# EAGLE design ISP_adapter2 (EAGLE 9.1.0)
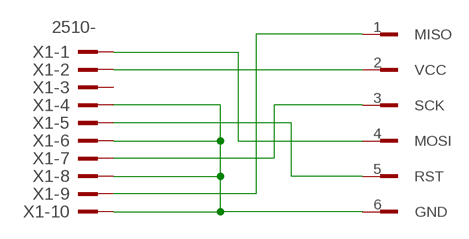
[diagram p0: schematic, sheet 1]

## Parts
U$1  ISP_CONN_6_MDRILL16  [ISP_CONN_6_M_DRILL16]
X1  2510-  [PAK100/2500-10]

## Nets
N$1: U$1.4(MOSI) X1.1
N$2: U$1.2(VCC) X1.2
N$3: U$1.6(GND) X1.4 X1.6 X1.8 X1.10
N$4: U$1.5(RST) X1.5
N$5: U$1.3(SCK) X1.7
N$6: U$1.1(MISO) X1.9
Unconnected: X1.3

## Library data of the parts
U$1 = altimeter:ISP_CONN_6_M
X1 = con-3m:2510-: 3M (TM) Pak 100 4-Wall Header Source: 3M; MF: 3M; MPN: 2510-6002UB; OC_FARNELL: 9838244; OC_NEWARK: 46F4725

## Board
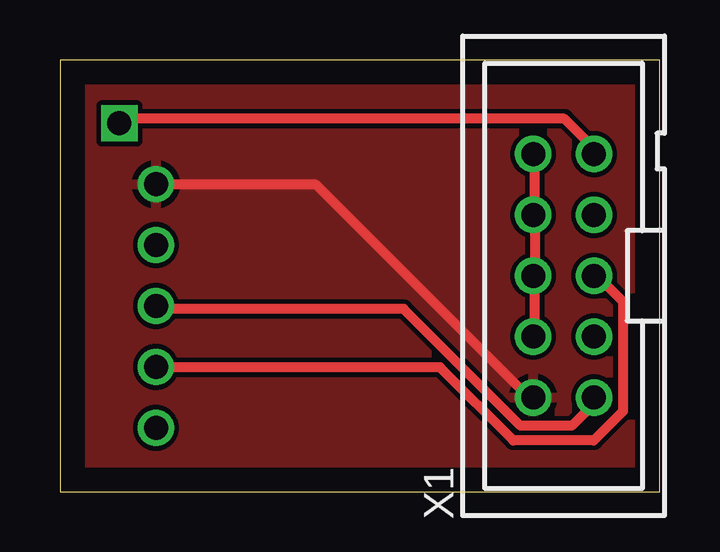
[diagram p1: board, top side]
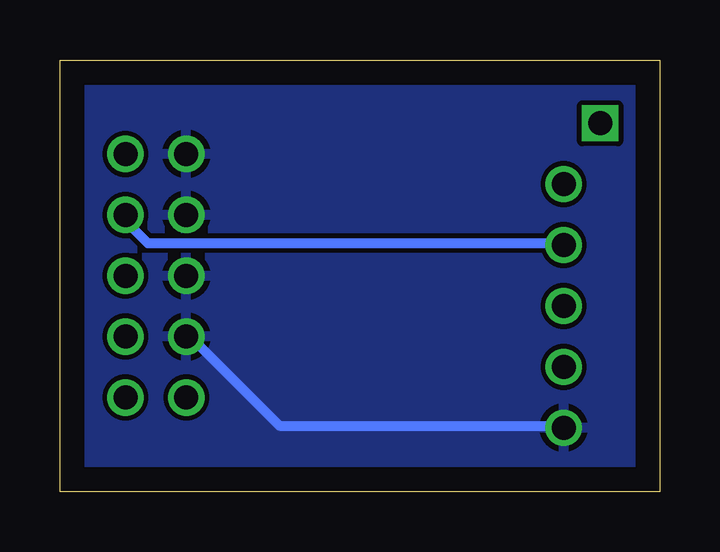
[diagram p2: board, bottom side, seen from below]

Size 25 x 18 mm. Coordinates in mm from the lower left corner, seen from the top.
Outline: 0,0 25,0 25,18 0,18 0,0
Copper layers (1*16): Top 0.035mm / dielectric 1.5mm / Bottom 0.035mm
Design rules "default *": minimum track width 16mil, minimum drill 0.5mm, track to track 8mil, track to pad 8mil, pad to pad 8mil, via to via 8mil, smd to smd 8mil, copper to edge 40mil, drill to drill 8mil, minimum pad ring 10mil, minimum via ring 8mil, stop-mask expansion 4mil, vias tented up to drill 0mil, thermal gap 10mil

### Footprints (pad centres in the part's own frame; a part is rotated, then mirrored left to right if it is on the bottom)
ISP_CONN_6_M_DRILL16 = drill 1 square: 1 -1.524,7.62 | drill 1: 2 0,5.08; 3 0,2.54; 4 0,0; 5 0,-2.54; 6 0,-5.08
PAK100/2500-10 = drill 1 pad 1.422: 1 -5.08,-1.27; 2 -5.08,1.27; 3 -2.54,-1.27; 4 -2.54,1.27; 5 0,-1.27; 6 0,1.27; 7 2.54,-1.27; 8 2.54,1.27; 9 5.08,-1.27; 10 5.08,1.27

### Placement (x,y rotation side)
U$1  4,7.74 0 top
X1  21,9 90 top

### Tracks (layer width: path | path; a pad name or v marks a point on that pad's centre or on a via)
N$1
  Top 0.406: U$1.4 4.27,7.62 14.33,7.62 19.2,2.74 21.34,2.74 22.25,3.66 X1.1
N$2
  Top 0.406: U$1.2 4.27,12.8 10.67,12.8 19.51,3.96 X1.2
  pour Top: 0,0 0,18 25,18 25,0
N$3
  Top 0.406: X1.10 19.81,14.02 19.81,11.58 X1.8 19.81,11.28 19.81,9.14 X1.6 19.81,8.84 19.81,6.71 X1.4
  Bottom 0.406: U$1.6 4.27,2.74 15.85,2.74 19.51,6.4 X1.4
  pour Bottom: 0,0 0,18 25,18 25,0
N$4
  Top 0.406: U$1.5 4.27,5.18 15.85,5.18 18.9,2.13 22.25,2.13 23.47,3.35 23.47,7.92 22.55,8.84 X1.5
N$5
  Bottom 0.406: U$1.3 4.27,10.36 21.34,10.36 22.25,11.28 X1.7
N$6
  Top 0.406: U$1.1 2.13,15.54 21.03,15.54 22.25,14.33 X1.9